# EAGLE design recever (EAGLE 9.6.2)
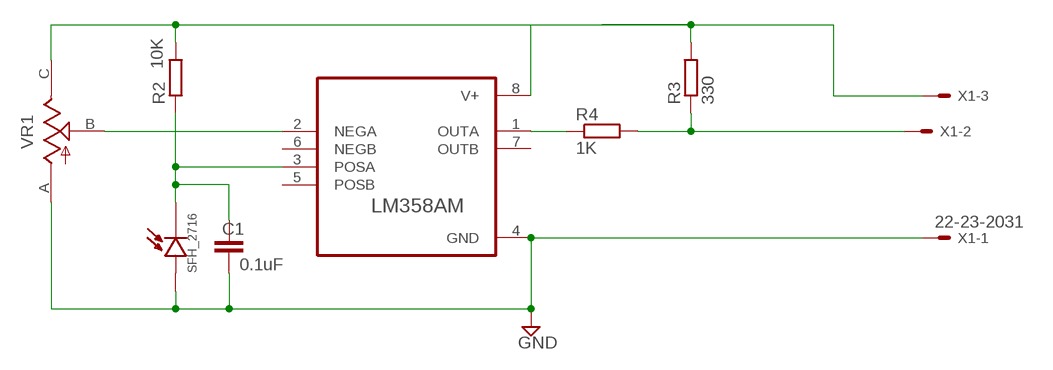
[diagram p0: schematic, sheet 1]

## Parts
C1  0.1uF  C-EUC1206  [C1206]
D1  SFH_2716  [LEDC2012X100N]
R2  10K  R-EU_R1206  [R1206]
R3  330  R-EU_R1206  [R1206]
R4  1K  R-EU_R1206  [R1206]
U1  LM358AM  [SOIC127P599X175-8N]
VR1  10K  TS53YJ103MR10  [TRIM_TS53YJ103MR10]
X1  22-23-2031  [22-23-2031]

## Nets
GND: C1.2 D1.A U1.4(GND) VR1.A X1.1
N$1: R2.2 R3.2 U1.8(V+) VR1.C X1.3
N$2: R3.1 R4.2 X1.2
N$3: U1.2(NEGA) VR1.B
N$4: C1.1 D1.C R2.1 U1.3(POSA)
N$5: R4.1 U1.1(OUTA)
Unconnected: U1.5(POSB) U1.6(NEGB) U1.7(OUTB)

## Library data of the parts
C1 = rcl:C-EU: CAPACITOR, European symbol; SPICEPREFIX: C
D1 = SFH_2716:SFH_2716: SENSOR PHOTODIODE 620NM SMD Check availability <https://pricing.snapeda.com/parts/SFH%202716/OSRAM%20Opto/view-part?ref=eda>; AVAILABILITY: In Stock; DESCRIPTION: Photodiode 620nm - 120° 0805 (2012 Metric); MF: OSRAM Opto; MP: SFH 2716; PACKAGE: 0805 OSRAM Opto Semiconductors; PRICE: None; PURCHASE-URL: https://pricing.snapeda.com/search/part/SFH 2716/?ref=eda
R2-R4 = rcl:R-EU_: RESISTOR, European symbol; SPICEPREFIX: R
U1 = LM358AM:LM358AM: Check availability <https://pricing.snapeda.com/parts/LM358AM/Texas%20Instruments/view-part?ref=eda>; AVAILABILITY: In Stock; DESCRIPTION: 2-Channel, 1MHz, industry standard, 32V op amp 8-SOIC 0 to 70; MF: Texas Instruments; MP: LM358AM; PACKAGE: SOIC-8 Texas Instruments; PRICE: None; PURCHASE-URL: https://pricing.snapeda.com/search/part/LM358AM/?ref=eda
VR1 = TS53YJ103MR10:TS53YJ103MR10: Res Cermet Trimmer 10K Ohm 20% 1/4W 1(Elec)/1(Mech)Turn 2.5mm (5 X 5.5 X 2.7mm) J-Hook SMD T/R Check availability <https://pricing.snapeda.com/parts/TS53YJ103MR10/Vishay/view-part?ref=eda>; AVAILABILITY: In Stock; DESCRIPTION: 10 kOhms 0.25W, 1/4W J Lead Surface Mount Trimmer Potentiometer Cermet 1.0 Turn Top Adjustment; MF: Vishay; MP: TS53YJ103MR10; PACKAGE: TSOP-34830 Vishay; PRICE: None; PURCHASE-URL: https://pricing.snapeda.com/search/part/TS53YJ103MR10/?ref=eda
X1 = con-molex:22-23-2031: .100" (2.54mm) Center Header - 3 Pin; MF: MOLEX; MPN: 22-23-2031; OC_FARNELL: 1462950; OC_NEWARK: 30C0862

## Board
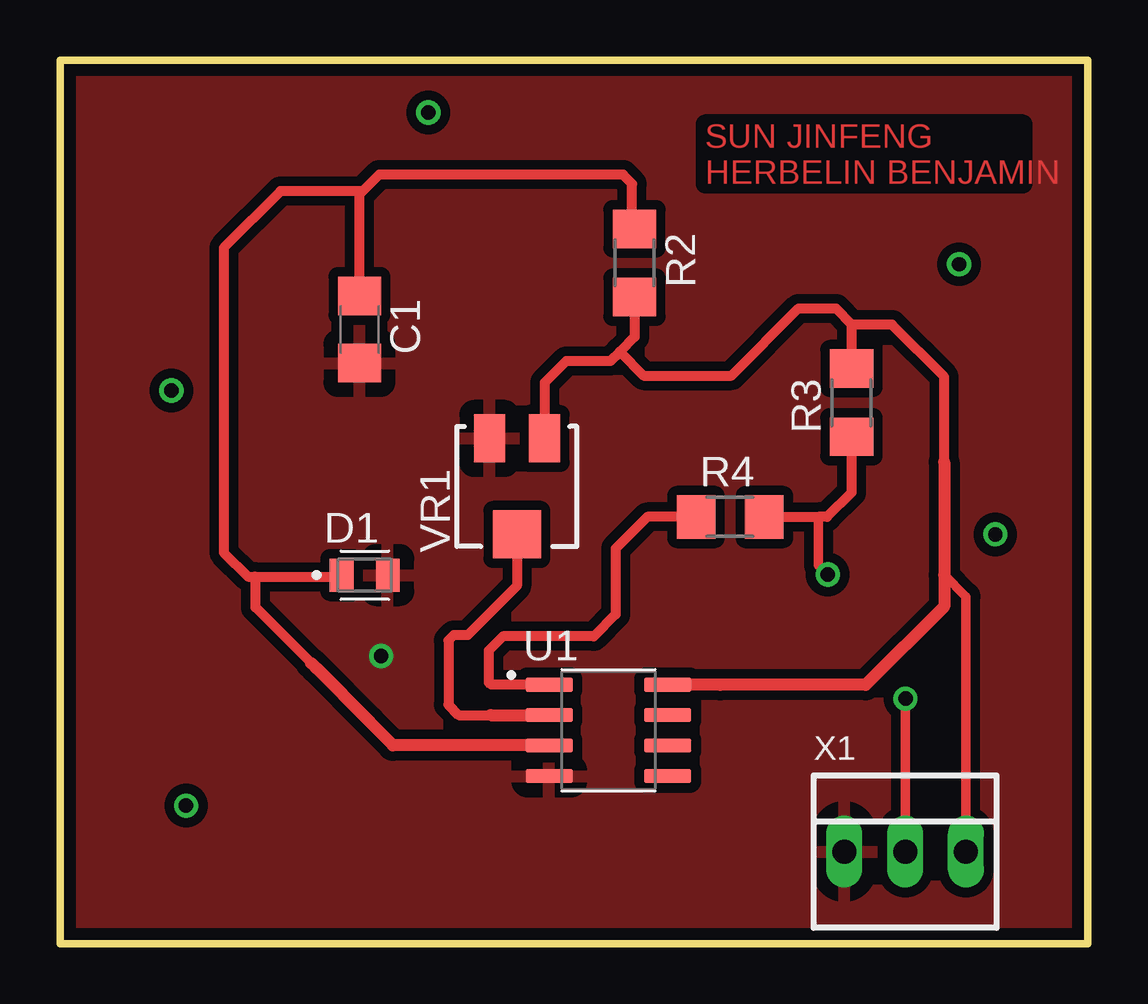
[diagram p1: board, top side]
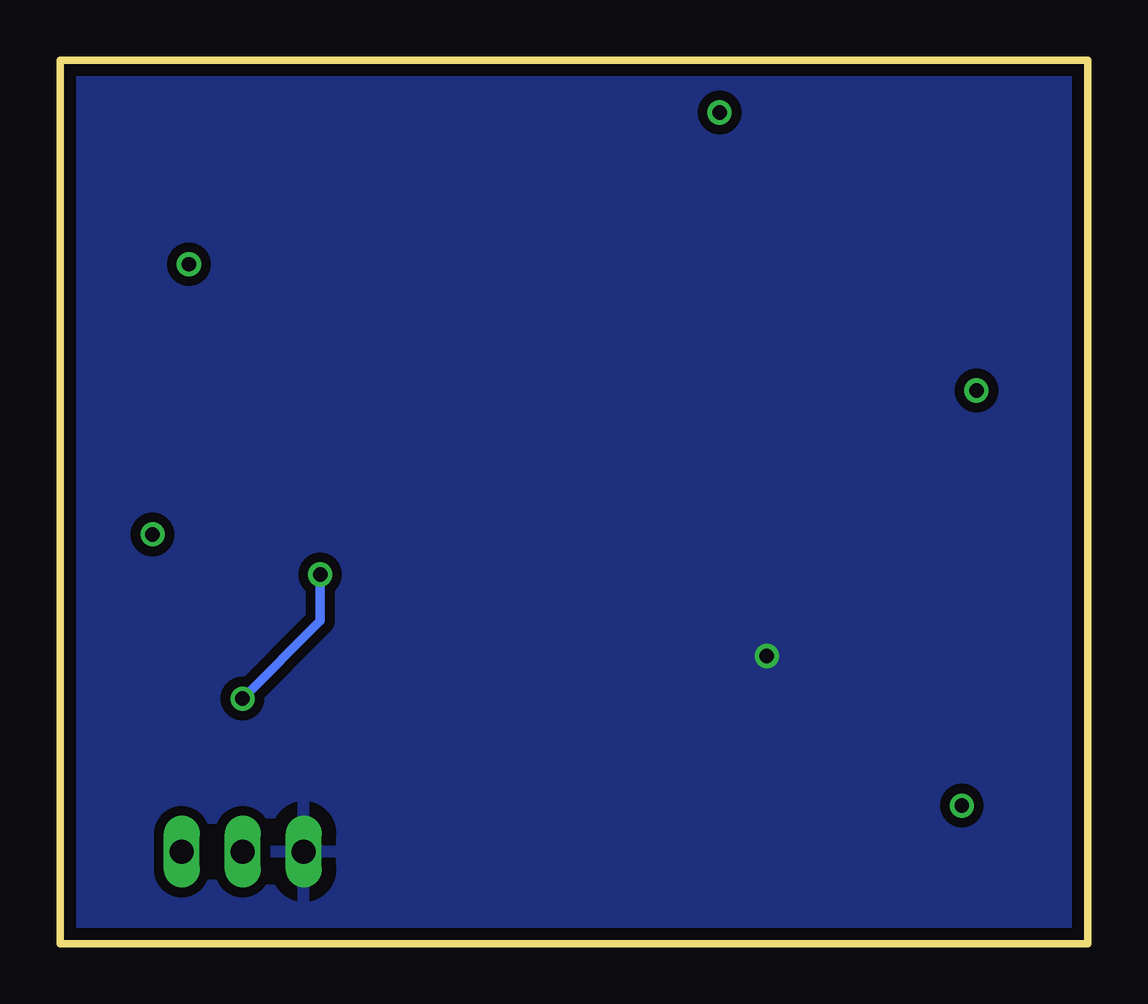
[diagram p2: board, bottom side, seen from below]

Size 42.85 x 36.82 mm. Coordinates in mm from the lower left corner, seen from the top.
Outline: 0,0 42.85,0 42.85,36.82 0,36.82 0,0
Copper layers (1*16): Top 0.035mm / dielectric 1.5mm / Bottom 0.035mm
Design rules "default *": minimum track width 0.4mm, minimum drill 0.6mm, track to track 0.4mm, track to pad 0.4mm, pad to pad 0.4mm, via to via 0.4mm, smd to smd 0.4mm, copper to edge 0.5mm, drill to drill 0.6mm, minimum pad ring 10mil, minimum via ring 8mil, stop-mask expansion 4mil, vias tented up to drill 0mil, thermal gap 0.6mm

### Footprints (pad centres in the part's own frame; a part is rotated, then mirrored left to right if it is on the bottom)
C1206 = smd 1.6 x 1.8: 1 -1.4,0; 2 1.4,0
LEDC2012X100N = smd 0.99 x 1.38: A 0.965,0; C -0.965,0
R1206 = smd 1.6 x 1.803: 1 -1.422,0; 2 1.422,0
SOIC127P599X175-8N = smd 1.97 x 0.6: 1 -2.47,1.905; 2 -2.47,0.635; 3 -2.47,-0.635; 4 -2.47,-1.905; 5 2.47,-1.905; 6 2.47,-0.635; 7 2.47,0.635; 8 2.47,1.905
TRIM_TS53YJ103MR10 = smd 2 x 1.3: A 2,1.15; C 2,-1.15 | smd 2 x 2: B -2,0
22-23-2031 = drill 1 long: 1 -2.54,0; 2 0,0; 3 2.54,0

### Placement (x,y rotation side)
C1  12.48,25.59 270 top
D1  12.7,15.35 0 top
R2  23.95,28.36 270 top
R3  32.99,22.54 90 top
R4  27.94,17.78 0 top
U1  22.86,8.89 0 top
VR1  19.05,19.05 90 top
X1  35.23,3.84 0 top

### Tracks (layer width: path | path; a pad name or v marks a point on that pad's centre or on a via)
GND  (via drill 0.6)
  other vias: 13.39,11.99
  pour Top: 0,36.83 0,0 42.71,0 42.71,36.83
  pour Bottom: 0,36.83 0,0 42.84,0 42.84,36.83
GND1  (via drill 0.6)
  other vias: 4.65,23.05
GND2  (via drill 0.6)
  other vias: 15.35,34.63
GND3  (via drill 0.6)
  other vias: 37.48,28.31
GND4  (via drill 0.6)
  other vias: 38.99,17.06
GND5  (via drill 0.6)
  other vias: 5.26,5.75
N$1
  Top 0.4: X1.3 37.77,14.46 36.86,15.37
  Top 0.406: R2.2 23.95,25.29 23.34,24.67 | 23.34,24.67 22.94,24.27 21.09,24.27 20.2,23.38 VR1.C | 36.86,20.07 36.86,23.62 34.68,25.79 32.99,25.79 | 23.34,24.67 24.33,23.67 27.99,23.67 30.79,26.47 32.35,26.47 32.99,25.82 32.99,25.79 | 32.99,25.79 R3.2
  Top 0.5: 20.32,21.15 VR1.C | 36.86,20.07 36.86,15.37 36.86,14.05 33.59,10.78 27.53,10.78 27.52,10.8 U1.8
N$2  (via drill 0.6)
  Top 0.4: 31.62,17.78 31.62,15.76 v32,15.38 | v35.24,10.21 35.24,3.85 X1.2
  Top 0.406: R4.2 31.62,17.78 31.98,17.78 32.99,18.8 R3.1
  Bottom 0.4: v32,15.38 32,13.45 v35.24,10.21
N$3
  Top 0.406: VR1.B 19.05,14.91 16.99,12.85 16.41,12.85 16.19,12.64 16.19,9.96 16.62,9.53 17.96,9.53
  Top 0.5: 17.96,9.53 U1.2
N$4
  Top 0.406: C1.1 12.48,31.22 12.62,31.36 | 12.62,31.36 13.31,32.04 23.47,32.04 23.85,31.66 23.85,29.88 R2.1 | D1.C 11.67,15.29 8.12,15.29 | 8.12,15.29 7.84,15.29 6.83,16.29 6.83,28.99 9.19,31.36 12.62,31.36 | 10.67,11.49 8.15,14.01 8.15,15.25 8.12,15.29
  Top 0.5: 11.68,15.44 D1.C | 12.63,26.87 C1.1 12.38,26.89 | 10.47,11.7 10.67,11.49 12.89,9.27 12.88,9.27 13.88,8.27 20.38,8.27 U1.3
N$5
  Top 0.406: R4.1 24.49,17.78 23.16,16.46 23.16,13.72 22.25,12.8 18.47,12.8 17.88,12.22 17.88,10.88 17.97,10.8 U1.1
  Top 0.5: 26.5,17.52 R4.1

### Text on the board
Top: SUN JINFENG / HERBELIN BENJAMIN